# EAGLE schematic USBPowerCut (EAGLE 9.6.2)
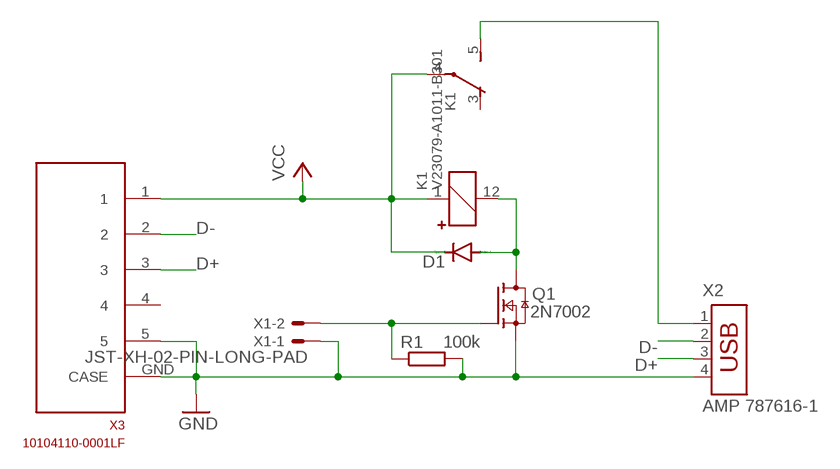
[diagram p0: schematic, sheet 1]

## Parts
D1  1N4148  1N4148DO35-10  [DO35-10]
K1  V23079-A1011-B301  V23079A  [V23079A]
Q1  2N7002  2N7002F  [SOT23]
R1  100k  R-EU_R0805  [R0805]
X1  JST-XH-02-PIN-LONG-PAD  [JST-XH-02-PACKAGE-LONG-PAD]
X2  AMP 787616-1  USB-787616  [USB]
X3  10104110-0001LF  [MICRO_USB]

## Nets
D+: X2.3 X3.3
D-: X2.2 X3.2
GND: Q1.2(S) R1.2 X1.1 X2.4 X3.5 X3.GND(CASE)
N$3: D1.A K1.12(-) Q1.3(D)
N$4: K1.5(S) X2.1
N$5: Q1.1(G) R1.1 X1.2
VCC: D1.C K1.1(+) K1.4(P) X3.1
Unconnected: K1.3(O) K1.8(S) K1.9(P) K1.10(O) X3.4

## Library data of the parts
D1 = diode:1N4148: DIODE high speed (Philips)
K1 = Siemens-Rel:V23079A
Q1 = nxp_60_1_1:2N7002: N-channel TrenchMOS FET N-channel enhancement mode Field-Effect Transistor (FET) in a plastic package using TrenchMOS technology. AAL Eindhoven MK
R1 = rcl:R-EU_: RESISTOR, European symbol; SPICEPREFIX: R
X1 = Rembrandt Electronics - JST XH Connectors v1-0:JST-XH-02-PIN: JST XH Connector 2 Pin Wire to board connector. Pitch: 2,54 mm, (0.100") Number of pins: 2 Created by Rembrandt Electronics www.rembrandtelectronics.com
X2 = con-amp:USB-787616: AMP connector
X3 = 10104110-0001LF:10104110-0001LF: USB - micro B USB 2.0 Receptacle Connector 5 Position Surface Mount, Right Angle Check prices <https://pricing.snapeda.com/parts/10104110-0001LF/Amphenol%20ICC/view-part?ref=eda>; AVAILABILITY: In Stock; DESCRIPTION: USB - micro B USB 2.0 Receptacle Connector 5 Position Surface Mount, Right Angle; MF: Amphenol ICC; MP: 10104110-0001LF; PACKAGE: None; PRICE: None; PURCHASE-URL: https://pricing.snapeda.com/search/part/10104110-0001LF/?ref=eda